# EAGLE design liftsensor (EAGLE 8.5.1)
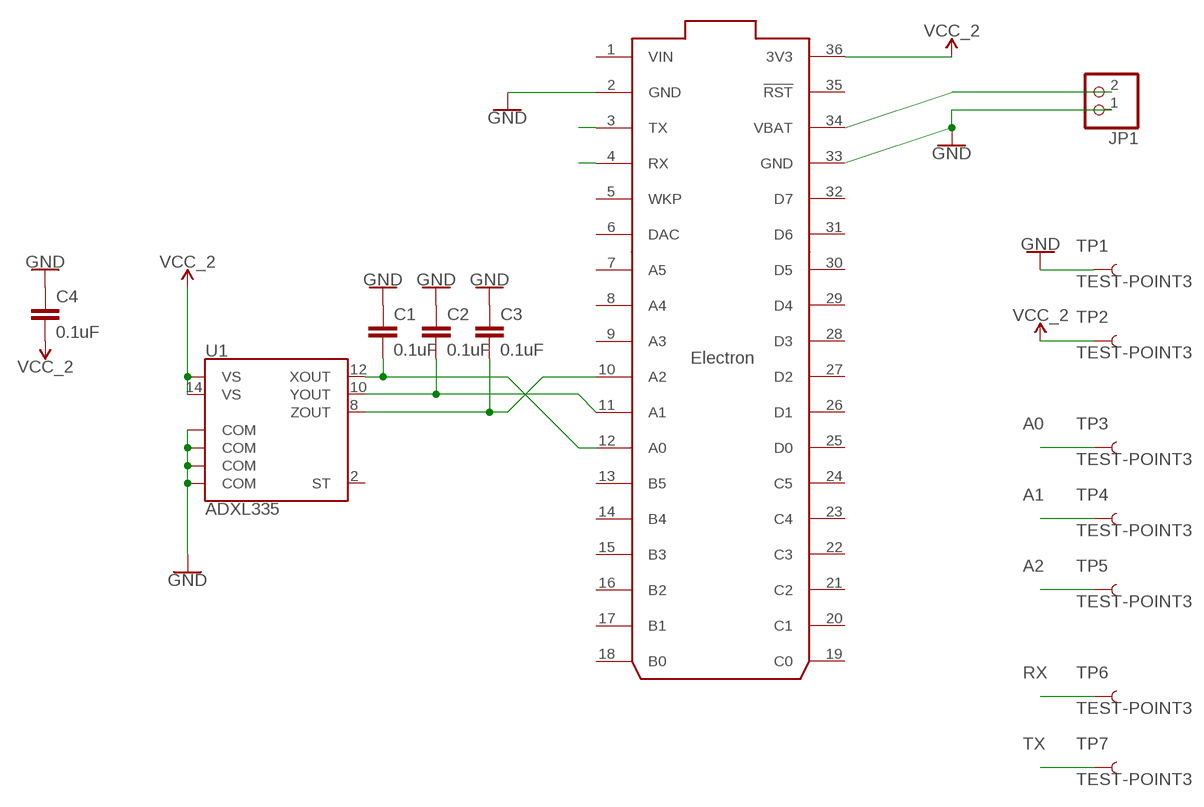
[diagram p0: schematic, sheet 1]

## Parts
C1  0.1uF  0.1UF-0603-25V-5%  [0603]
C2  0.1uF  0.1UF-0603-25V-5%  [0603]
C3  0.1uF  0.1UF-0603-25V-5%  [0603]
C4  0.1uF  0.1UF-0603-25V-5%  [0603]
EL  ELECTRON_WITH_HEADERS  [ELECTRON]
JP1  PINHD-1X2/90  [1X02/90]
TP1  TEST-POINT3  [PAD.03X.03]
TP2  TEST-POINT3  [PAD.03X.03]
TP3  TEST-POINT3  [PAD.03X.03]
TP4  TEST-POINT3  [PAD.03X.03]
TP5  TEST-POINT3  [PAD.03X.03]
TP6  TEST-POINT3  [PAD.03X.03]
TP7  TEST-POINT3  [PAD.03X.03]
U1  ADXL335  [LFCSP-16-4X4]

## Nets
A0: C1.2 EL.12(A0) TP3.P$1 U1.12(XOUT)
A1: C2.2 EL.11(A1) TP4.P$1 U1.10(YOUT)
A2: C3.2 EL.10(A2) TP5.P$1 U1.8(ZOUT)
GND: C1.1 C2.1 C3.1 C4.1 EL.2(GND) EL.33(GND) JP1.1 TP1.P$1 U1.3(COM) U1.5(COM) U1.6(COM) U1.7(COM)
RX: EL.4(RX) TP6.P$1
TX: EL.3(TX) TP7.P$1
VBAT: EL.34(VBAT) JP1.2
VCC_2: C4.2 EL.36(3V3) TP2.P$1 U1.14(VS) U1.15(VS)
Unconnected: EL.5(WKP) EL.6(DAC) EL.7(A5) EL.8(A4) EL.9(A3) EL.13(B5) EL.14(B4) EL.15(B3) EL.16(B2) EL.17(B1) EL.18(B0) EL.19(C0) EL.20(C1) EL.21(C2) EL.22(C3) EL.23(C4) EL.24(C5) EL.25(D0) EL.26(D1) EL.27(D2) EL.28(D3) EL.29(D4) EL.30(D5) EL.31(D6) EL.32(D7) EL.35(!RST) U1.2(ST)

## Power pins joined to a net without a drawn wire
VIN: EL.1(VIN)

## Library data of the parts
C1-C4 = SparkFun-Capacitors:0.1UF: 0.1µF ceramic capacitors A capacitor is a passive two-terminal electrical component used to store electrical energy temporarily in an electric field.; PROD_ID: CAP-08604
EL = Particle-Devices:ELECTRON: Particle Electron footprint
JP1 = pinhead:PINHD-1X2: PIN HEADER
TP1-TP7 = SparkFun-Connectors:TEST-POINT: SparkFun Test Points Bare copper test points for troubleshooting or In-Circuit-Testing. These are used by our Production team for verifying production board runs using pogo-pins on test beds. SparkFun Products: SparkFun LSM9DS1 Breakout <https://www.sparkfun.com/products/13284> SparkFun PSOC <https://www.sparkfun.com/products/13714> SparkFun Load Cell Amplifier <https://www.sparkfun.com/products/13879>
U1 = SparkFun-Sensors:ADXL335: Analog Devices ADXL335 3-Axis Analog Accelerometer The ADXL335 is a small, thin, low power, complete 3-axis accelerometer with signal conditioned voltage outputs. The product measures acceleration with a minimum full-scale range of ±3 g. It can measure the static acceleration of gravity in tiltsensing applications, as well as dynamic acceleration resulting from motion, shock, or vibration. Datasheet <https://www.sparkfun.com/datasheets/Components/SMD/adxl335.pdf> SparkFun Products SparkFun Triple Axis Accelerometer Breakout - ADXL335 <https://www.sparkfun.com/products/9269> (SEN-09269) Triple Axis Accelerometer - ADXL335 <https://www.sparkfun.com/products/9265> (SEN-09265); PROD_ID: IC-08942; SF_ID: COM-09265

## Board
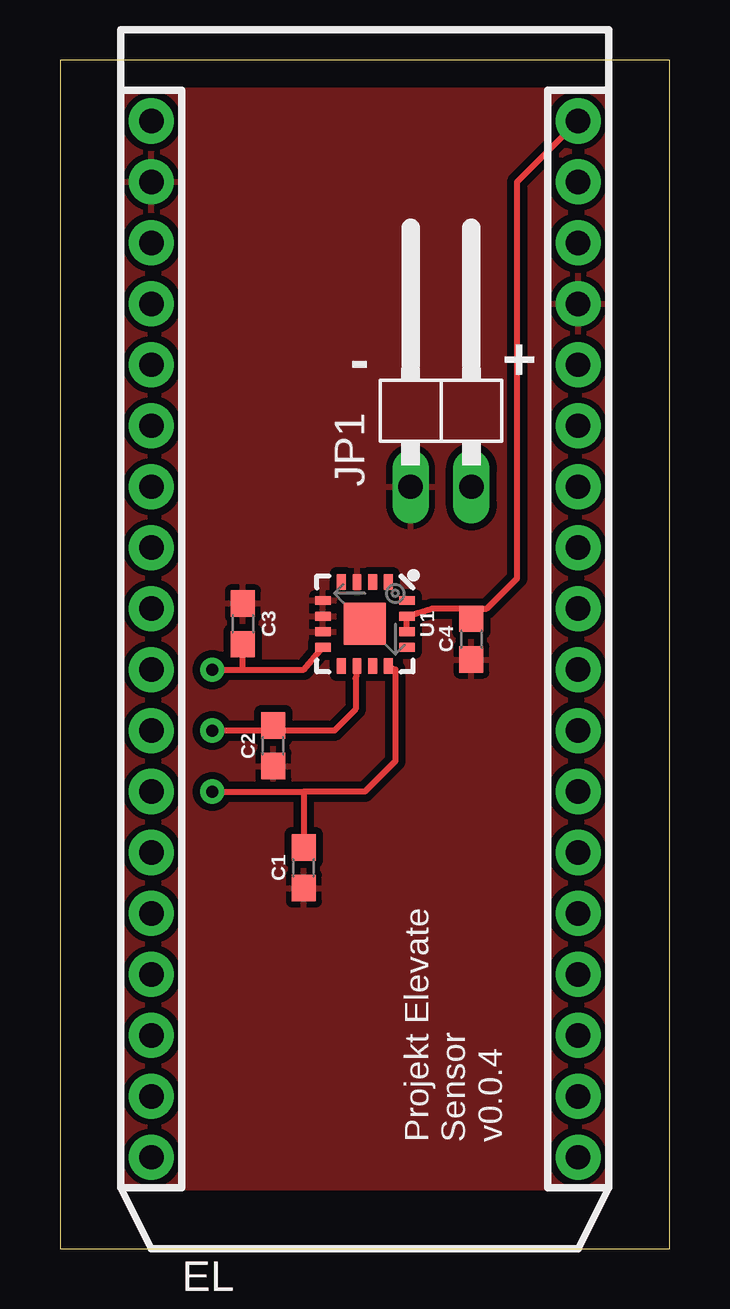
[diagram p1: board, top side]
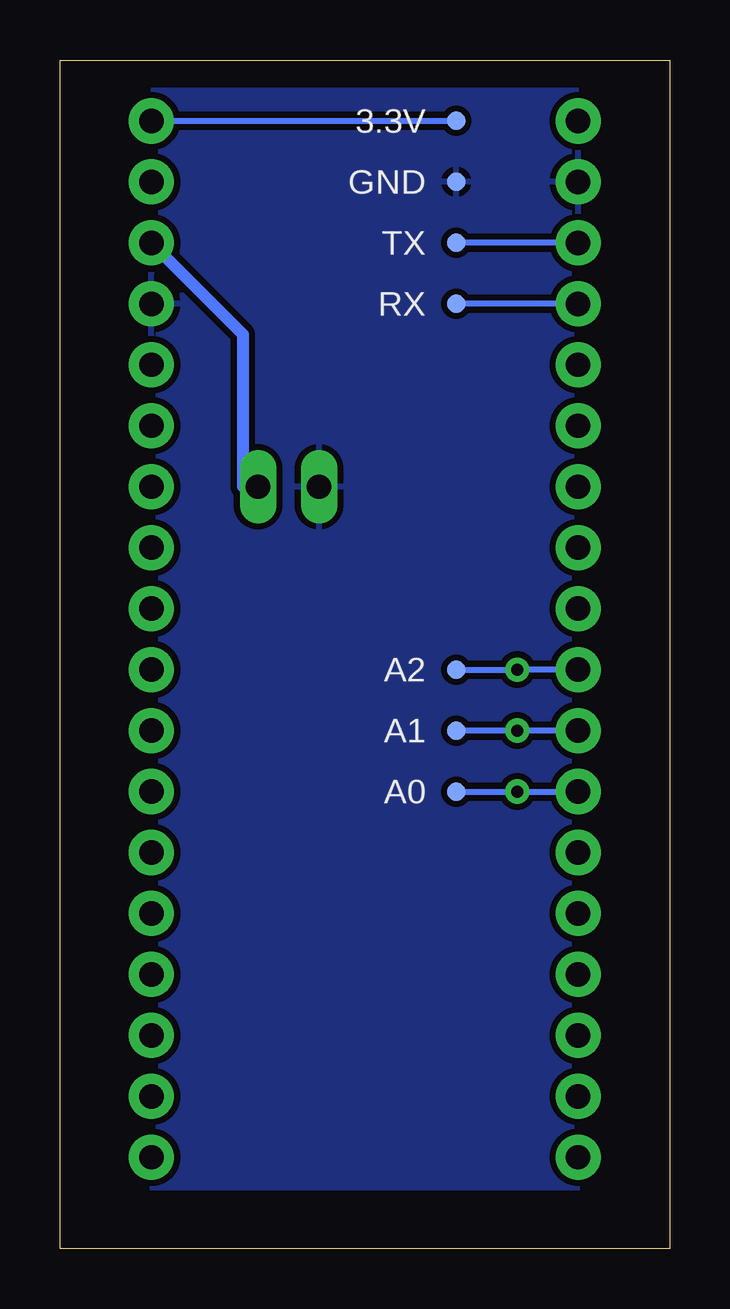
[diagram p2: board, bottom side, seen from below]

Size 25.4 x 49.53 mm. Coordinates in mm from the lower left corner, seen from the top.
Outline: 0,0 25.4,0 25.4,49.53 0,49.53 0,0
Copper layers (1*16): Top 0.035mm / dielectric 1.5mm / Bottom 0.035mm
Design rules "SparkFun-2-layer-STANDARD": minimum track width 10mil, minimum drill 20mil, track to track 10mil, track to pad 8mil, pad to pad 8mil, via to via 10mil, smd to smd 8mil, copper to edge 8mil, drill to drill 8mil, minimum pad ring 10mil, minimum via ring 10mil, stop-mask expansion 4mil, vias tented up to drill 25mil, thermal gap 10mil

### Footprints (pad centres in the part's own frame; a part is rotated, then mirrored left to right if it is on the bottom)
0603 = smd 1.1 x 1: 1 -0.85,0; 2 0.85,0
ELECTRON = drill 1.016 pad 1.88: 1 1.27,46.99; 2 1.27,44.45; 3 1.27,41.91; 4 1.27,39.37; 5 1.27,36.83; 6 1.27,34.29; 7 1.27,31.75; 8 1.27,29.21; 9 1.27,26.67; 10 1.27,24.13; 11 1.27,21.59; 12 1.27,19.05; 13 1.27,16.51; 14 1.27,13.97; 15 1.27,11.43; 16 1.27,8.89; 17 1.27,6.35; 18 1.27,3.81; 19 19.05,3.81; 20 19.05,6.35; 21 19.05,8.89; 22 19.05,11.43; 23 19.05,13.97; 24 19.05,16.51; 25 19.05,19.05; 26 19.05,21.59; 27 19.05,24.13; 28 19.05,26.67; 29 19.05,29.21; 30 19.05,31.75; 31 19.05,34.29; 32 19.05,36.83; 33 19.05,39.37; 34 19.05,41.91; 35 19.05,44.45; 36 19.05,46.99
1X02/90 = drill 1.016 long: 1 -1.27,-3.81; 2 1.27,-3.81
PAD.03X.03 = smd 0.762 x 0.762: P$1 0,0
LFCSP-16-4X4 = smd 1.75 x 1.75: 0 0,0 | smd 0.65 x 0.37: 1 -1.75,0.975; 2 -1.75,0.325; 3 -1.75,-0.325; 4 -1.75,-0.975; 9 1.75,-0.975; 10 1.75,-0.325; 11 1.75,0.325; 12 1.75,0.975 | smd 0.37 x 0.65: 5 -0.975,-1.75; 6 -0.325,-1.75; 7 0.325,-1.75; 8 0.975,-1.75; 13 0.975,1.75; 14 0.325,1.75; 15 -0.325,1.75; 16 -0.975,1.75

### Placement (x,y rotation side)
C1  10.16,15.88 90 top
C2  8.89,20.96 90 top
C3  7.62,26.04 270 top
C4  17.14,25.4 90 top
EL  2.54,0 0 top
JP1  15.88,35.56 0 top
TP1  8.89,44.45 0 bottom
TP2  8.89,46.99 0 bottom
TP3  8.89,19.05 0 bottom
TP4  8.89,21.59 0 bottom
TP5  8.89,24.13 0 bottom
TP6  8.89,39.37 0 bottom
TP7  8.89,41.91 0 bottom
U1  12.7,26.04 270 top

### Tracks (layer width: path | path; a pad name or v marks a point on that pad's centre or on a via)
A0  (via drill 0.5)
  Top 0.254: U1.12 13.97,24.13 13.97,20.32 12.7,19.05 10.16,19.05 | 10.16,19.05 C1.2 | v6.35,19.05 10.16,19.05
  Bottom 0.254: TP3.P$1 v6.35,19.05 EL.12
A1  (via drill 0.5)
  Top 0.254: U1.10 12.32,23.75 12.32,22.48 11.43,21.59 9.11,21.59 | 9.11,21.59 v6.35,21.59 | 9.11,21.59 C2.2
  Bottom 0.254: EL.11 v6.35,21.59 TP4.P$1
A2  (via drill 0.5)
  Top 0.254: U1.8 10.16,24.13 7.62,24.13 | v6.35,24.13 7.62,24.13 | 7.62,24.13 C3.2
  Bottom 0.254: TP5.P$1 v6.35,24.13 EL.10
GND
  pour Top (isolate 0.305): 2.54,48.26 22.86,48.26 22.86,2.54 2.54,2.54
  pour Bottom: 21.59,48.26 3.81,48.26 3.81,2.54 21.59,2.54
N$1
  pour Top (rank 2): 2.54,48.26 22.86,48.26 22.86,2.54 2.54,2.54
RX
  Bottom 0.254: EL.4 TP6.P$1
TX
  Bottom 0.254: EL.3 TP7.P$1
VBAT
  Bottom 0.254: 17.78,31.75 JP1.2
  Bottom 0.508: EL.34 17.78,38.1 17.78,31.75
VCC_2
  Top 0.254: U1.14 U1.15 15.49,26.67 17.14,26.67 | C4.2 17.14,26.67 | 17.14,26.67 17.78,26.67 19.05,27.94 19.05,44.45 EL.36
  Bottom 0.254: EL.36 TP2.P$1

### Text on the board
tPlace: - | + | Projekt Elevate / Sensor / v0.0.4
bPlace: 3.3V | GND | TX | RX | A2 | A1 | A0